# EAGLE design mainv2_2 (EAGLE 6.5.0)
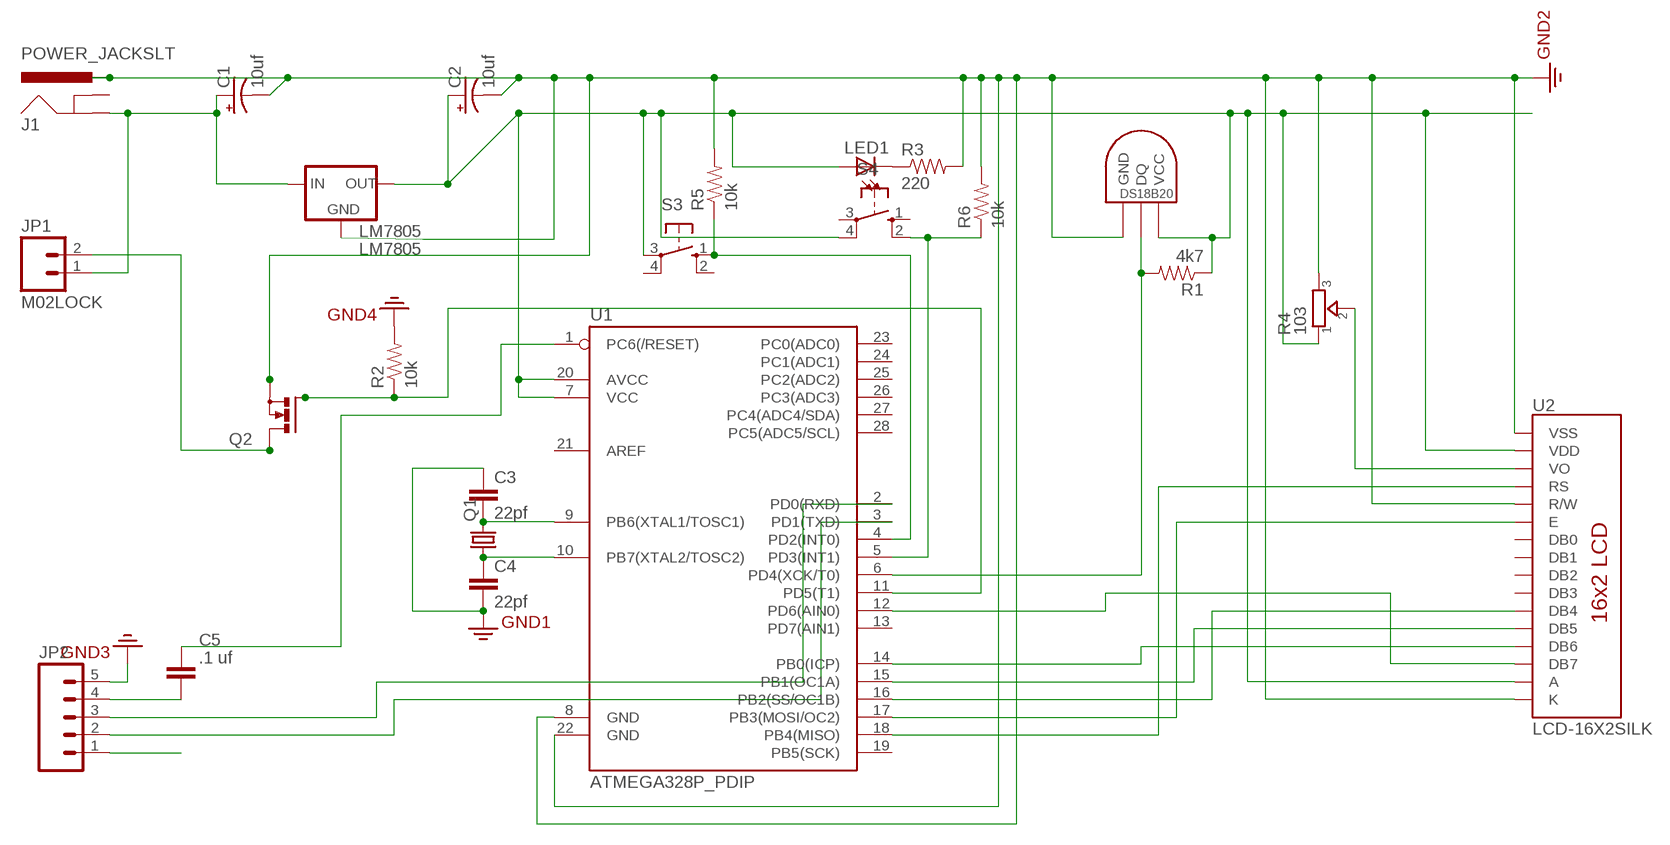
[diagram p0: schematic, sheet 1]

## Parts
C1  10uf  10UF-25V-20%(PTH)  [CPOL-RADIAL-10UF-25V]
C2  10uf  10UF-25V-20%(PTH)  [CPOL-RADIAL-10UF-25V]
C3  22pf  CAPPTH2  [CAP-PTH-SMALL2]
C4  22pf  CAPPTH2  [CAP-PTH-SMALL2]
C5  .1 uf  CAPACITOR_NPOL-PTH_0.1"  [C0.1PTH]
J1  POWER_JACKSLT  [POWER_JACK_SLOT]
JP1  M02LOCK  [1X02_LOCK]
JP2  M05PTH  [1X05]
LED1  LED3MM  [LED3MM]
LM7805  LM7805  V_REG_78XXSINK  [TO220-IGO]
Q1  CRYSTALHC49S  [HC49/S]
Q2  PMOSFET_NTO220BV  [TO220BV]
R1  4k7  RESISTORAXIAL-0.3  [AXIAL-0.3]
R2  10k  RESISTORAXIAL-0.3  [AXIAL-0.3]
R3  220  RESISTORAXIAL-0.3  [AXIAL-0.3]
R4  103  TRIMMER-3306F  [TRIMMER_3306F]
R5  10k  RESISTORAXIAL-0.3  [AXIAL-0.3]
R6  10k  RESISTORAXIAL-0.3  [AXIAL-0.3]
S3  10-XX  [B3F-10XX]
S4  10-XX  [B3F-10XX]
U1  ATMEGA328P_PDIP  [DIL28-3]
U2  LCD-16X2SILK  [LCD-16X2]
U$1  DS1820TO92  [DS1820]

## Nets
+12: C1.1(+) J1.GND@2(GND) JP1.1 LM7805.IN
GND: C1.2(-) C2.2(-) C3.1 C4.2 J1.PWR JP2.5 LM7805.GND Q2.S R2.P$2 R3.P$2 R4.3 R5.P$2 R6.P$2 U1.8(GND) U1.22(GND) U2.1(VSS) U2.5(R/W) U2.16(K) U$1.GND ; supply symbol labelled GND2
N$1: C5.2 JP2.4
N$2: C5.1 U1.1(PC6(/RESET))
N$4: U1.16(PB2(SS/OC1B)) U2.11(DB4)
N$5: C3.2 Q1.2 U1.9(PB6(XTAL1/TOSC1))
N$6: C4.1 Q1.1 U1.10(PB7(XTAL2/TOSC2))
N$7: U1.15(PB1(OC1A)) U2.12(DB5)
N$8: U1.14(PB0(ICP)) U2.13(DB6)
N$9: U1.18(PB4(MISO)) U2.4(RS)
N$10: U1.17(PB3(MOSI/OC2)) U2.6(E)
N$11: R4.2 U2.3(VO)
N$12: U1.12(PD6(AIN0)) U2.14(DB7)
N$15: Q2.G R2.P$1 U1.11(PD5(T1))
N$17: R5.P$1 S3.1(S) U1.4(PD2(INT0))
N$18: JP1.2 Q2.D
N$19: LED1.K(C) R3.P$1
N$20: R6.P$1 S4.2(S1) U1.5(PD3(INT1))
N$21: JP2.2 U1.3(PD1(TXD))
N$22: JP2.3 U1.2(PD0(RXD))
TEMP: R1.P$2 U1.6(PD4(XCK/T0)) U$1.DQ
VCC: C2.1(+) JP2.1 LED1.A LM7805.OUT R1.P$1 R4.1 S3.3(P) S4.4(P1) U1.7(VCC) U1.20(AVCC) U2.2(VDD) U2.15(A) U$1.VDD(VCC)
Unconnected: J1.GND@1(GNDBREAK) S3.2(S1) S3.4(P1) S4.1(S) S4.3(P) U1.13(PD7(AIN1)) U1.19(PB5(SCK)) U1.21(AREF) U1.23(PC0(ADC0)) U1.24(PC1(ADC1)) U1.25(PC2(ADC2)) U1.26(PC3(ADC3)) U1.27(PC4(ADC4/SDA)) U1.28(PC5(ADC5/SCL)) U2.7(DB0) U2.8(DB1) U2.9(DB2) U2.10(DB3)

## Library data of the parts
C1 C2 = SparkFun-Capacitors:10UF-25V-20%(PTH): CAP-08440; PROD_ID: CAP-08440
C3 C4 = SparkFun-Capacitors:CAP: Capacitor Standard 0603 ceramic capacitor, and 0.1" leaded capacitor.
C5 = dp_devices:CAPACITOR_NPOL: Non-Polarized capacitor in various packages
J1 = SparkFun-Connectors:POWER_JACK: Power Jack This is the standard 5.5mm barrel jack for power. The PTH is the most common, proven, reliable, footprint. The Slot footprint only works if the mill layer is transmitted to the PCB fab house so be warned. Mating wall wart : TOL-00298 (and others); PROD_ID: PRT-00119
JP1 = SparkFun-Connectors:M02: Standard 2-pin 0.1" header. Use with - straight break away headers ( PRT-00116) - right angle break away headers (PRT-00553) - swiss pins (PRT-00743) - machine pins (PRT-00117) - female headers (PRT-00115) Molex polarized connector foot print use with: PRT-08233 with associated crimp pins and housings. 2.54_SCREWTERM for use with PRT-10571. 3.5mm Screw Terminal footprints for PRT-08084 5mm Screw Terminal footprints for use with PRT-08433
JP2 = SparkFun-Connectors:M05: Header 5 Standard 5-pin 0.1" header. Use with straight break away headers (SKU : PRT-00116), right angle break away headers (PRT-00553), swiss pins (PRT-00743), machine pins (PRT-00117), and female headers (PRT-00115). Molex polarized connector foot print use with SKU : PRT-08230 with associated crimp pins and housings.
LED1 = SparkFun-LED:LED: LEDs Standard schematic elements and footprints for 5mm, 3mm, 1206, and 0603 sized LEDs. 5mm - Spark Fun Electronics SKU : COM-00529 (and others)
LM7805 = SparkFun-PowerIC:V_REG_78XX: Voltage Regulator Standard 7805 5V regulator. IGO (Input Ground Output). Spark Fun Electronics SKU : COM-00107
Q1 = crystal:CRYSTAL: CRYSTAL; OC_FARNELL: 1667008; OC_NEWARK: unknown
Q2 = transistor-power:PMOSFET_N: Power MOSFET N-Channel
R1-R3 R5 R6 = SparkFun-Resistors:RESISTOR: Resistor Basic schematic elements and footprints for 0603, 1206, and PTH resistors.
R4 = dp_devices:TRIMMER: Trimmer resistor
S3 S4 = switch-omron:10-XX: OMRON SWITCH; MPN: B3F-1000; OC_FARNELL: 176432; OC_NEWARK: 36M3542
U1 = SparkFun-DigitalIC:ATMEGA328P_PDIP: uC used in the Arduino 32kb flash, 1k EEPROM, 2k SRAM This is the through-hole version of this chip.
U2 = SparkFun-Displays:LCD-16X2: Standard text-only 16x2 parallel input LCD
U$1 = Ava:DS1820: DS18B20 Programmable Resolution 1-Wire Digital Thermometer Description The DS18B20 digital thermometer provides 9-bit to 12-bit Celsius temperature measurements and has an alarm function with nonvolatile user-programmable upper and lower trigger points. The DS18B20 communicates over a 1-Wire® bus that by definition requires only one data line (and ground) for communication with a central microprocessor. It has an operating temperature range of -55°C to +125°C and is accurate to ±0.5°C over the range of -10°C to +85°C. In addition, the DS18B20 can derive power directly from the data line ("parasite power"), eliminating the need for an external power supply. Each DS18B20 has a unique 64-bit serial code, which allows multiple DS18B20s to function on the same 1-Wire bus. Thus, it is simple to use one microprocessor to control many DS18B20s distributed over a large area. Applications that can benefit from this feature include HVAC environmental controls, temperature monitoring systems inside buildings, equipment, or machinery, and process monitoring and control systems.

## Board
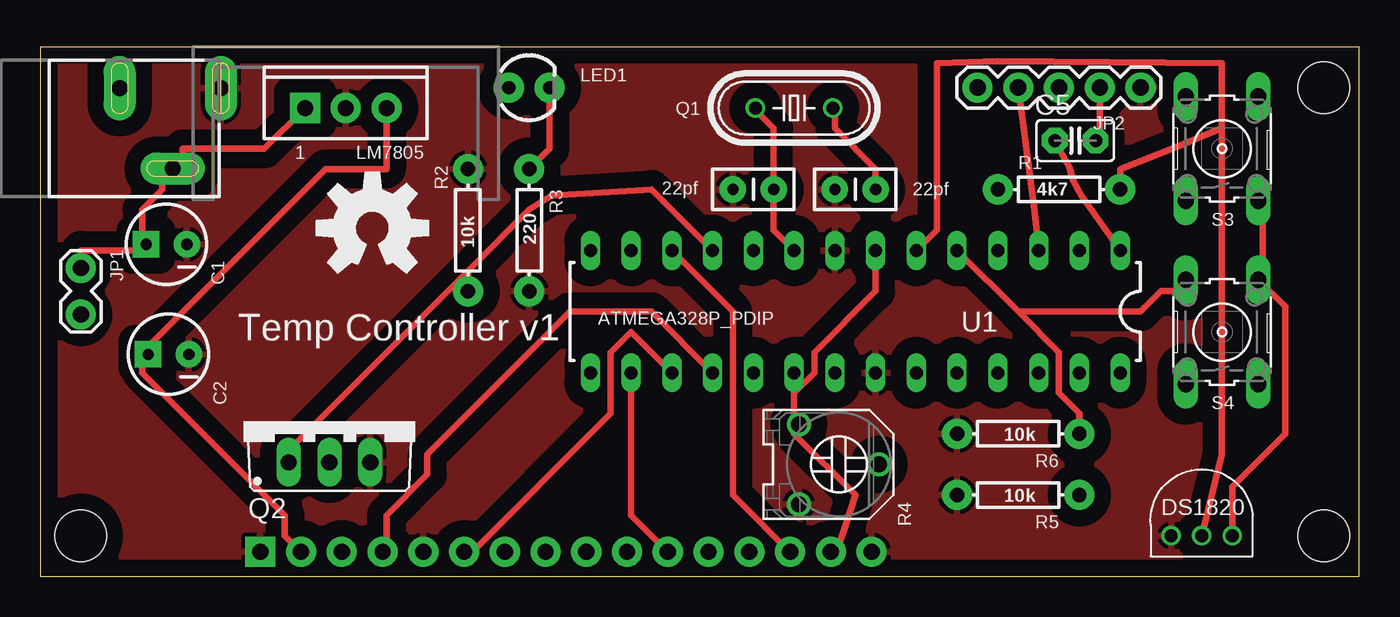
[diagram p1: board, top side]
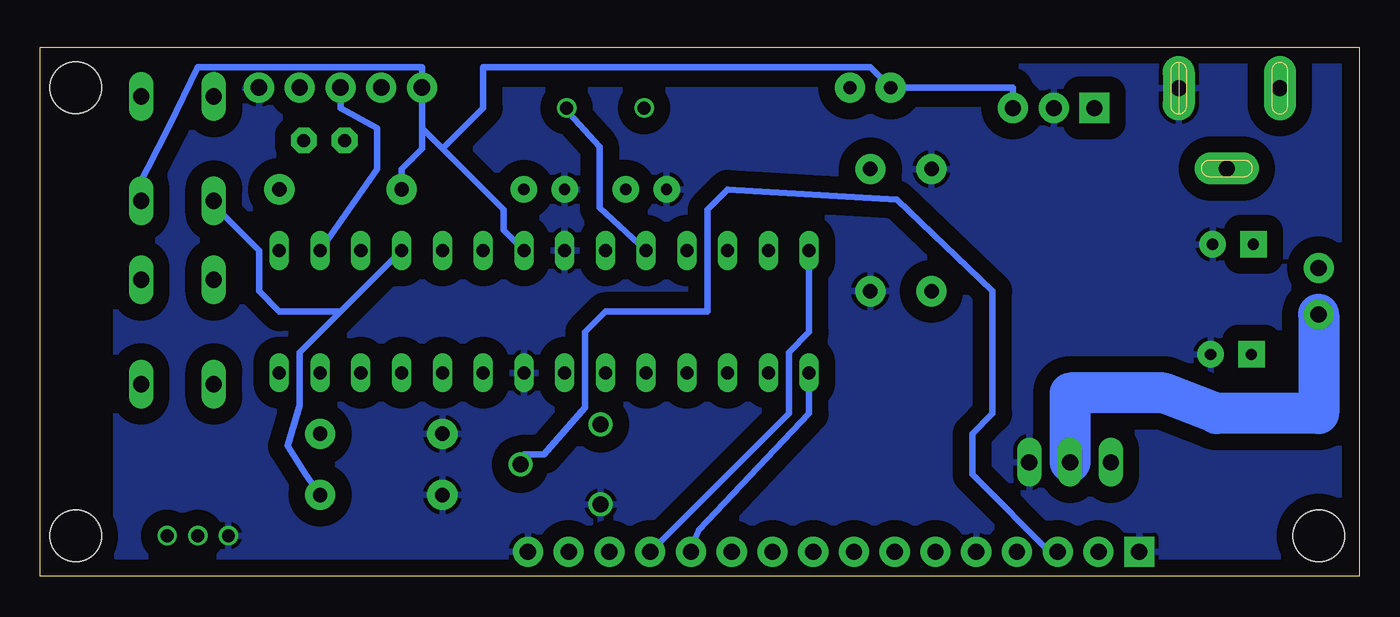
[diagram p2: board, bottom side, seen from below]

Size 82.22 x 33.01 mm. Coordinates in mm from the lower left corner, seen from the top.
Outline: 0,0 82.22,0 82.22,33.01 0,33.01 0,0
Copper layers (1*16): Top 0.0356mm / dielectric 1.5011mm / Bottom 0.0356mm
Design rules "LaenPCBOrder": minimum track width 6mil, minimum drill 13mil, track to track 6mil, track to pad 6mil, pad to pad 6mil, via to via 6mil, smd to smd 6mil, copper to edge 15mil, drill to drill 6mil, minimum pad ring 7mil, minimum via ring 7mil, stop-mask expansion 3mil, vias tented up to drill 0mil, thermal gap 10mil
Holes 3.2 mm at 2.54,2.54 80.01,2.54 80.01,30.48

### Footprints (pad centres in the part's own frame; a part is rotated, then mirrored left to right if it is on the bottom)
CPOL-RADIAL-10UF-25V = drill 0.7 pad 1.651 square: 1 1.27,0 | drill 0.7 pad 1.651: 2 -1.27,0
CAP-PTH-SMALL2 = drill 0.7 pad 1.651: 1 0,0; 2 2.54,0
C0.1PTH = drill 0.813 pad 1.6 octagon: 1 -1.27,0; 2 1.27,0
POWER_JACK_SLOT = drill 1 pad 2 long: GND@1 2.58,7.5; GND@2 7.58,10.8; PWR 2.58,13.8
1X02_LOCK = drill 1.016 pad 1.88: 1 -0.178,0; 2 2.718,0
1X05 = drill 1.016 pad 1.88: 1 0,0; 2 2.54,0; 3 5.08,0; 4 7.62,0; 5 10.16,0
LED3MM = drill 0.813 pad 1.88: A -1.27,0; K 1.27,0
TO220-IGO = drill 1 pad 1.88: GND 0,0; OUT 2.54,0 | drill 1 pad 1.88 square: IN -2.54,0
HC49/S = drill 0.813: 1 -2.413,0; 2 2.413,0
TO220BV = drill 1.016 long: D 0,-2.54; G -2.54,-2.54; S 2.54,-2.54
AXIAL-0.3 = drill 0.9 pad 1.88: P$1 -3.81,0; P$2 3.81,0
TRIMMER_3306F = drill 1: 1 -2.5,-2.5; 2 0,2.5; 3 2.5,-2.5
B3F-10XX = drill 1.016 long: 1 -3.251,2.261; 2 3.251,2.261; 3 -3.251,-2.261; 4 3.251,-2.261
DIL28-3 = drill 0.813 long: 1 -16.51,-3.81; 2 -13.97,-3.81; 3 -11.43,-3.81; 4 -8.89,-3.81; 5 -6.35,-3.81; 6 -3.81,-3.81; 7 -1.27,-3.81; 8 1.27,-3.81; 9 3.81,-3.81; 10 6.35,-3.81; 11 8.89,-3.81; 12 11.43,-3.81; 13 13.97,-3.81; 14 16.51,-3.81; 15 16.51,3.81; 16 13.97,3.81; 17 11.43,3.81; 18 8.89,3.81; 19 6.35,3.81; 20 3.81,3.81; 21 1.27,3.81; 22 -1.27,3.81; 23 -3.81,3.81; 24 -6.35,3.81; 25 -8.89,3.81; 26 -11.43,3.81; 27 -13.97,3.81; 28 -16.51,3.81
LCD-16X2 = drill 1.016 pad 1.88 square: 1 -32,15.5 | drill 1.016 pad 1.88: 2 -29.46,15.5; 3 -26.92,15.5; 4 -24.38,15.5; 5 -21.84,15.5; 6 -19.3,15.5; 7 -16.76,15.5; 8 -14.22,15.5; 9 -11.68,15.5; 10 -9.14,15.5; 11 -6.6,15.5; 12 -4.06,15.5; 13 -1.52,15.5; 14 1.02,15.5; 15 3.56,15.5; 16 6.1,15.5
DS1820 = drill 0.8: DQ 2.54,-1.27; GND 0.635,-1.27; VDD 4.445,-1.27

### Placement (x,y rotation side)
C1  7.87,20.7 180 top
C2  8,13.84 180 top
C3  43.18,24.13 0 top
C4  52.07,24.13 180 top
C5  64.52,27.18 0 top
J1  -2.54,33.02 270 top
JP1  2.54,19.05 270 top
JP2  58.42,30.48 0 top
LED1  30.48,30.48 0 top
LM7805  19.05,29.21 0 top
Q1  46.99,29.21 180 top
Q2  18.03,9.65 0 top
R1  63.5,24.13 0 top
R2  26.67,21.59 90 top
R3  30.48,21.59 270 top
R4  49.78,6.98 270 top
R5  60.96,5.08 180 top
R6  60.96,8.89 180 top
S3  73.66,26.67 90 top
S4  73.66,15.24 90 top
U1  50.8,16.51 180 top
U2  45.72,-13.97 0 top
U$1  69.85,3.81 0 top
U$3  [OSHW-LOGO-L]  20.7,21.72 0 top

### Tracks (layer width: path | path; a pad name or v marks a point on that pad's centre or on a via)
+12
  Top 0.406: 6.35,20.32 2.54,20.32 JP1.1 2.54,19.05 | LM7805.IN 13.97,26.67 8.89,26.67 8.89,25.4 J1.GND@2 7.62,25.4 7.62,24.13 6.35,22.86 6.35,20.32 | 6.35,20.32 C1.1
GND
  pour Top (isolate 1.016): 1.27,33.02 77.47,33.02 77.47,1.27 1.27,1.27
  pour Bottom (isolate 1.016): 1.27,33.02 77.47,33.02 77.47,1.27 1.27,1.27
N$1
  Top 0.406: JP2.4 66.04,27.94 C5.2
N$2
  Top 0.406: U1.1 64.9,23.75 64.39,24.64 64.14,25.53 63.5,26.67 C5.1
N$4
  Top 0.152: 39.37,1.27 U2.11
  Top 0.406: U1.16 36.83,3.81 39.37,1.27
N$5
  Top 0.406: U1.9 45.72,21.59 C3.2 45.72,27.94 44.45,29.21 Q1.2
N$6
  Top 0.406: C4.1 52.07,25.4 49.53,27.94 49.53,29.21 Q1.1
  Bottom 0.406: U1.10 47.37,22.99 47.37,26.8 49.53,29.21 Q1.1
N$7
  Bottom 0.406: U1.15 34.29,10.16 41.15,2.92 41.91,1.27 U2.12
N$8
  Bottom 0.152: 44.45,1.27 U2.13
  Bottom 0.406: U1.14 34.29,15.24 35.56,13.97 35.56,10.16 44.45,1.27
N$9
  Top 0.406: U1.18 38.1,16.51 33.02,16.51 24.13,7.62 24.13,6.35 21.59,3.81 21.59,1.27 U2.4
N$10
  Top 0.406: U1.17 36.83,15.24 35.56,13.97 35.56,10.16 26.67,1.27 U2.6
N$11
  Bottom 0.406: R4.2 52.07,7.62 50.8,7.62 48.26,10.54 48.26,15.24 46.99,16.51 40.64,16.51 40.64,22.86 39.37,24.13 28.83,23.49 22.86,17.78 22.86,10.16 24.13,8.89 24.13,6.35 19.05,1.27 U2.3
N$12
  Top 0.152: 46.99,1.27 U2.14
  Top 0.406: U1.12 43.18,16.51 43.18,5.08 46.99,1.27
N$15
  Top 0.406: U1.11 38.1,24.13 31.88,23.75 30.48,22.86 26.67,19.05 | R2.P$1 26.67,19.05 | 26.67,19.05 15.24,7.62 Q2.G
N$17
  Bottom 0.406: 63.5,16.51 66.04,13.97 66.04,10.67 66.8,8.13 65.66,6.35 R5.P$1 | 63.5,16.51 U1.4 | 63.5,16.51 67.31,16.51 68.58,17.78 68.58,20.32 71.12,22.86 S3.1
N$18
  Bottom 0.406: 2.54,16.51 JP1.2
  Bottom 2.54: JP1.2 2.54,10.16 8.89,10.16 12.19,11.43 18.03,11.43 18.03,7.24 Q2.D
N$19
  Top 0.406: R3.P$1 31.75,26.67 LED1.K
N$20
  Top 0.406: 60.96,16.51 63.5,13.97 63.5,11.43 64.77,10.16 R6.P$1 | 60.96,16.51 U1.5 | 60.96,16.51 68.58,16.51 69.85,17.78 71.12,17.78 S4.2
N$21
  Top 0.406: U1.3 61.98,22.86 JP2.2
N$22
  Bottom 0.406: U1.2 61.21,25.4 61.21,27.94 63.5,29.21 JP2.3
TEMP
  Top 0.406: U$1.DQ 73.66,7.62 73.66,27.94 | 73.66,27.94 70.87,26.8 67.31,25.4 R1.P$2 | U1.6 55.88,21.59 55.88,32 59.69,32.13 73.66,32 73.66,27.94
VCC
  Top 0.152: 16.51,1.27 U2.2
  Top 0.406: 6.35,13.97 17.78,25.4 21.59,25.4 LM7805.OUT | 16.51,1.27 15.24,2.54 15.24,3.81 6.35,12.7 6.35,13.97 | 6.35,13.97 C2.1 | 46.99,11.43 46.99,10.16 R4.1 46.99,8.89 50.8,5.08 50.16,3.05 49.53,1.27 U2.15 | 46.99,11.43 U1.20 | U1.7 52.07,17.78 48.26,13.97 48.26,12.7 46.99,11.43 | S3.3 76.2,22.86 76.2,19.05 S4.4 77.6,16.81 77.6,8.89 74.3,5.59 U$1.VDD
  Bottom 0.406: LM7805.OUT 21.59,30.48 LED1.A 30.48,31.75 54.61,31.75 54.61,29.21 57.15,26.67 | 58.42,27.94 58.42,26.67 59.69,25.4 R1.P$1 | 58.42,27.94 JP2.1 58.42,31.75 72.39,31.75 74.17,28.07 76.2,24.13 S3.3 | U1.7 53.34,21.59 53.34,22.86 57.15,26.67 | 58.42,27.94 57.15,26.67

### Text on the board
tNames: 1 | LM7805
_tsilk: Temp Controller v1